# Altium schematic sheet src.SchDoc
size A3
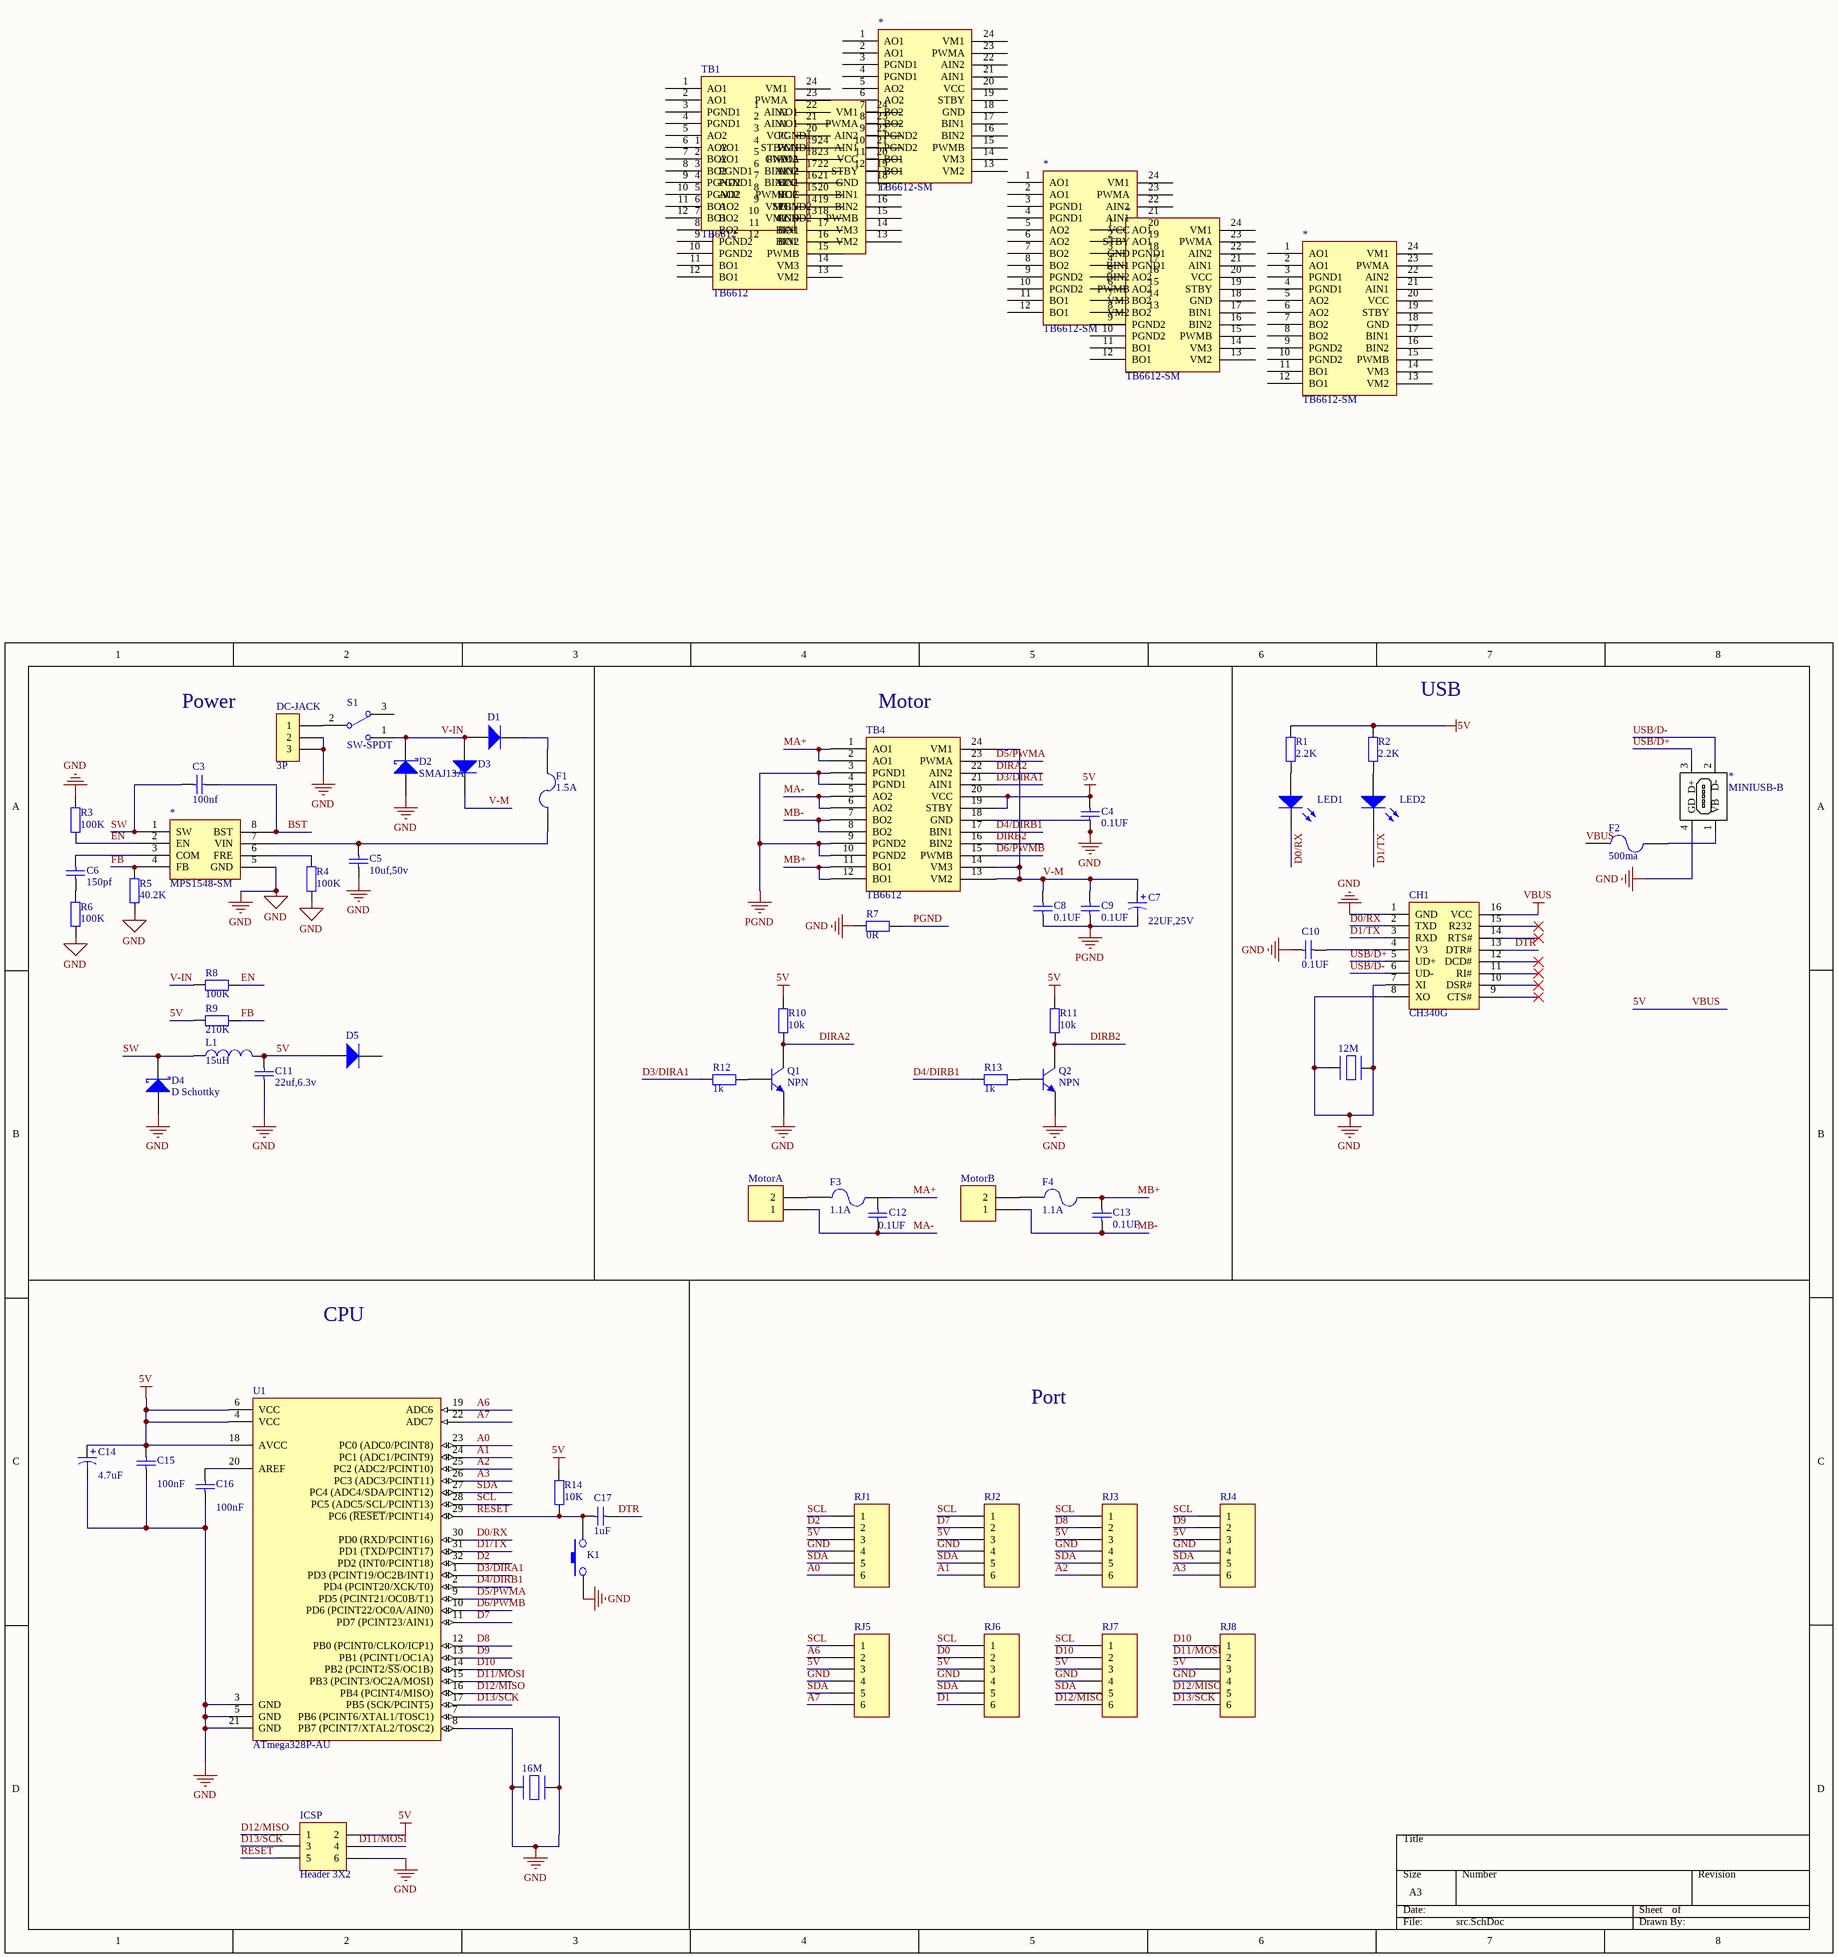
[diagram p0: src.SchDoc]

## Parts
(Parts that share a designator on the sheet are numbered #1, #2 ... from top to bottom, then left to right.)
12M  Crystal-SM  [CRYSTAL-SM]  (value not drawn)
16M  Crystal-SM  [CRYSTAL-SM]  (value not drawn)
*#1  MINIUSB-B  [MINUSB-B]
*#2  TB6612-SM  [SSOP-24]
*#3  MPS1548-SM  [SOP-8]
*#4  TB6612-SM  [SSOP-24]
*#5  TB6612-SM  [SSOP-24]
*#6  TB6612-SM  [SSOP-24]
C3  value 100nf  [C0603]  (hidden comment: Capacitor)
C4  value 0.1UF  [C0603]  (hidden comment: Capacitor)
C5  value 10uf,50v  [C1206]  (hidden comment: Capacitor)
C6  value 150pf  [C0603]  (hidden comment: Capacitor)
C7  value 22UF,25V  [AC10UF-4x5]  (hidden comment: Cap Pol3)
C8  value 0.1UF  [C0603]  (hidden comment: Capacitor)
C9  value 0.1UF  [C0603]  (hidden comment: Capacitor)
C10  value 0.1UF  [C0603]  (hidden comment: Capacitor)
C11  value 22uf,6.3v  [C1206]  (hidden comment: Capacitor)
C12  value 0.1UF  [C0603]  (hidden comment: Capacitor)
C13  value 0.1UF  [C0603]  (hidden comment: Capacitor)
C14  value 4.7uF  [TC3216-A]  (hidden comment: Cap Pol1)
C15  value 100nF  [C0603]  (hidden comment: Cap Semi)
C16  value 100nF  [C0603]  (hidden comment: Cap Semi)
C17  value 1uF  [C0805]  (hidden comment: Cap Semi)
CH1  CH340G  [SO16]
D1  Diode  [SMA]  (value not drawn)
D2  SMAJ13A  [SMA]
D3  Diode  [SMA]  (value not drawn)
D4  D Schottky  [SMA]
D5  Diode  [SMA]  (value not drawn)
DC-JACK  3P  [DC-JACK-005]
F1  1.5A  [R1812]
F2  500ma  [R1812]
F3  1.1A  [R1812]
F4  1.1A  [R1812]
ICSP  Header 3X2  [HDR2X3]
K1  Key-SM  [KEY-SM-3x6x5]  (value not drawn)
L1  value 15uH  [L0630-M]  (hidden comment: Inductor)
LED1  LED  [C0603]  (value not drawn)
LED2  LED  [C0603]  (value not drawn)
MotorA  HDR2-  (value not drawn)
MotorB  HDR2-  (value not drawn)
Q1  NPN  [SOT-23]
Q2  NPN  [SOT-23]
R1  value 2.2K  [R0603]  (hidden comment: Resistor)
R2  value 2.2K  [R0603]  (hidden comment: Resistor)
R3  value 100K  [R0603]  (hidden comment: Resistor)
R4  value 100K  [R0603]  (hidden comment: Resistor)
R5  value 40.2K  [R0603]  (hidden comment: Resistor)
R6  value 100K  [R0603]  (hidden comment: Resistor)
R7  value 0R  [R0603]  (hidden comment: Resistor)
R8  value 100K  [R0603]  (hidden comment: Resistor)
R9  value 210K  [R0603]  (hidden comment: Resistor)
R10  value 10k  [R0603]  (hidden comment: Resistor)
R11  value 10k  [R0603]  (hidden comment: Resistor)
R12  value 1k  [R0603]  (hidden comment: Resistor)
R13  value 1k  [R0603]  (hidden comment: Resistor)
R14  value 10K  [R0603]  (hidden comment: Resistor)
RJ1  RJ12 port  [RJ12-S-12X15X14.5]  (value not drawn)
RJ2  RJ12 port  [RJ12-S-12X15X14.5]  (value not drawn)
RJ3  RJ12 port  [RJ12-S-12X15X14.5]  (value not drawn)
RJ4  RJ12 port  [RJ12-S-12X15X14.5]  (value not drawn)
RJ5  RJ12 port  [RJ12-S-12X15X14.5]  (value not drawn)
RJ6  RJ12 port  [RJ12-S-12X15X14.5]  (value not drawn)
RJ7  RJ12 port  [RJ12-S-12X15X14.5]  (value not drawn)
RJ8  RJ12 port  [RJ12-S-12X15X14.5]  (value not drawn)
S1  SW-SPDT  [TL36WW15050]
TB1  TB6612  [SSOP-24]
TB2  TB6612  [SSOP-24]
TB3  TB6612  [SSOP-24]
TB4  TB6612  [SSOP-24]
U1  ATmega328P-AU  [32A_N]

## Nets
5V: C4.2 C11.1 C14.1 C15.2 CH1.16(VCC) D5.1(A) F2.1 ICSP.2 L1.2 R1.1 R2.1 R9.2 R10.2 R11.2 R14.2 RJ1.3 RJ2.3 RJ3.3 RJ4.3 RJ5.3 RJ6.3 RJ7.3 RJ8.3 TB4.19(STBY) TB4.20(VCC) U1.4(VCC) U1.6(VCC) U1.18(AVCC)  [also labelled VBUS]
GND: 12M.1 12M.2 16M.1 16M.2 *#1.4(GD) *#3.5(GND) C4.1 C5.2 C10.2 C11.2 C14.2 C15.1 C16.1 CH1.1(GND) CH1.7(XI) CH1.8(XO) D2.1(A) D4.1(A) DC-JACK.2 DC-JACK.3 ICSP.6 K1.1 Q1.3(E) Q2.3(E) R3.1 R4.1 R5.1 R6.1 R7.1 RJ1.4 RJ2.4 RJ3.4 RJ4.4 RJ5.4 RJ6.4 RJ7.4 RJ8.4 TB4.18(GND) U1.3(GND) U1.5(GND) U1.7(PB6_(PCINT6/XTAL1/TOSC1)) U1.8(PB7_(PCINT7/XTAL2/TOSC2)) U1.21(GND)
PGND: C7.2 C8.1 C9.1 R7.2 TB4.3(PGND1) TB4.4(PGND1) TB4.9(PGND2) TB4.10(PGND2)
A0: RJ1.6 U1.23(PC0_(ADC0/PCINT8))
A1: RJ2.6 U1.24(PC1_(ADC1/PCINT9))
A2: RJ3.6 U1.25(PC2_(ADC2/PCINT10))
A3: RJ4.6 U1.26(PC3_(ADC3/PCINT11))
A6: RJ5.2 U1.19(ADC6)
A7: RJ5.6 U1.22(ADC7)
BST: *#3.8(BST) C3.2
D0: RJ6.2
D0/RX: CH1.2(TXD) LED1.2(K) U1.30(PD0_(RXD/PCINT16))
D1: RJ6.6
D1/TX: CH1.3(RXD) LED2.2(K) U1.31(PD1_(TXD/PCINT17))
D2: RJ1.2 U1.32(PD2_(INT0/PCINT18))
D3/DIRA1: R12.2 TB4.21(AIN1) U1.1(PD3_(PCINT19/OC2B/INT1))
D4/DIRB1: R13.2 TB4.17(BIN1) U1.2(PD4_(PCINT20/XCK/T0))
D5/PWMA: TB4.23(PWMA) U1.9(PD5_(PCINT21/OC0B/T1))
D6/PWMB: TB4.15(PWMB) U1.10(PD6_(PCINT22/OC0A/AIN0))
D7: RJ2.2 U1.11(PD7_(PCINT23/AIN1))
D8: RJ3.2 U1.12(PB0_(PCINT0/CLKO/ICP1))
D9: RJ4.2 U1.13(PB1_(PCINT1/OC1A))
D10: RJ7.2 RJ8.1 U1.14(PB2_(PCINT2/~{SS}/OC1B))
D11/MOSI: RJ8.2 U1.15(PB3_(PCINT3/OC2A/MOSI))
D12/MISO: ICSP.1 RJ7.6 RJ8.5 U1.16(PB4_(PCINT4/MISO))
D13/SCK: ICSP.3 RJ8.6 U1.17(PB5_(SCK/PCINT5))
DIRA2: Q1.1(C) R10.1 TB4.22(AIN2)
DIRB2: Q2.1(C) R11.1 TB4.16(BIN2)
DTR: C17.1 CH1.13(DTR#)
EN: *#3.2(EN) R3.2 R8.1
FB: *#3.4(FB) R5.2 R9.1
MA+: F3.2 TB4.1(AO1) TB4.2(AO1)
MA-: C12.1 MotorA.1 TB4.5(AO2) TB4.6(AO2)
MB+: C13.2 F4.2 TB4.11(BO1) TB4.12(BO1)
MB-: C13.1 MotorB.1 TB4.7(BO2) TB4.8(BO2)
RESET: C17.2 ICSP.5 K1.2 R14.1 U1.29(PC6_(~{RESET}/PCINT14))
SCL: RJ1.1 RJ2.1 RJ3.1 RJ4.1 RJ5.1 RJ6.1 RJ7.1 U1.28(PC5_(ADC5/SCL/PCINT13))
SDA: RJ1.5 RJ2.5 RJ3.5 RJ4.5 RJ5.5 RJ6.5 RJ7.5 U1.27(PC4_(ADC4/SDA/PCINT12))
SW: *#3.1(SW) C3.1 D4.2(K) L1.1
USB/D+: *#1.3(D+) CH1.5(UD+)
USB/D-: *#1.2(D-) CH1.6(UD-)
V-IN: D1.1(A) D2.2(K) D3.1(A) R8.2 S1.1
V-M: C7.1 C8.2 C9.2 D3.2(K) TB4.13(VM2) TB4.14(VM3) TB4.24(VM1)
Net*#1_1: *#1.1(VB) F2.2
Net*#2_10: *#2.10(PGND2) TB3.24(VM1)
Net*#2_11: *#2.11(BO1) TB3.23(PWMA)
Net*#2_12: *#2.12(BO1) TB3.22(AIN2)
Net*#3_3: *#3.3(COM) C6.1
Net*#3_6: *#3.6(FRE) R4.2
Net*#3_7: *#3.7(VIN) C5.1 F1.2
NetC6_2: C6.2 R6.2
NetC10_1: C10.1 CH1.4(V3)
NetC16_2: C16.2 U1.20(AREF)
NetD1_2: D1.2(K) F1.1
NetDC-JACK_1: DC-JACK.1 S1.2
NetF3_1: F3.1 MotorA.2
NetF4_1: F4.1 MotorB.2
NetLED1_1: LED1.1(A) R1.2
NetLED2_1: LED2.1(A) R2.2
NetQ1_2: Q1.2(B) R12.1
NetQ2_2: Q2.2(B) R13.1

Not connected (* = marked no-connect by the designer): *#2 1(AO1) 2(AO1) 3(PGND1) 4(PGND1) 5(AO2) 6(AO2) 7(BO2) 8(BO2) 9(PGND2) 13(VM2) 14(VM3) 15(PWMB) 16(BIN2) 17(BIN1) 18(GND) 19(STBY) 20(VCC) 21(AIN1) 22(AIN2) 23(PWMA) 24(VM1); *#4 1(AO1) 2(AO1) 3(PGND1) 4(PGND1) 5(AO2) 6(AO2) 7(BO2) 8(BO2) 9(PGND2) 10(PGND2) 11(BO1) 12(BO1) 13(VM2) 14(VM3) 15(PWMB) 16(BIN2) 17(BIN1) 18(GND) 19(STBY) 20(VCC) 21(AIN1) 22(AIN2) 23(PWMA) 24(VM1); *#5 1(AO1) 2(AO1) 3(PGND1) 4(PGND1) 5(AO2) 6(AO2) 7(BO2) 8(BO2) 9(PGND2) 10(PGND2) 11(BO1) 12(BO1) 13(VM2) 14(VM3) 15(PWMB) 16(BIN2) 17(BIN1) 18(GND) 19(STBY) 20(VCC) 21(AIN1) 22(AIN2) 23(PWMA) 24(VM1); *#6 1(AO1) 2(AO1) 3(PGND1) 4(PGND1) 5(AO2) 6(AO2) 7(BO2) 8(BO2) 9(PGND2) 10(PGND2) 11(BO1) 12(BO1) 13(VM2) 14(VM3) 15(PWMB) 16(BIN2) 17(BIN1) 18(GND) 19(STBY) 20(VCC) 21(AIN1) 22(AIN2) 23(PWMA) 24(VM1); C12 2; CH1 9(CTS#)* 10(DSR#)* 11(RI#)* 12(DCD#)* 14(RTS#)* 15(R232)*; D5 2(K); ICSP 4; S1 3; TB1 1(AO1) 2(AO1) 3(PGND1) 4(PGND1) 5(AO2) 6(AO2) 7(BO2) 8(BO2) 9(PGND2) 10(PGND2) 11(BO1) 12(BO1) 13(VM2) 14(VM3) 15(PWMB) 16(BIN2) 17(BIN1) 18(GND) 19(STBY) 20(VCC) 21(AIN1) 22(AIN2) 23(PWMA) 24(VM1); TB2 1(AO1) 2(AO1) 3(PGND1) 4(PGND1) 5(AO2) 6(AO2) 7(BO2) 8(BO2) 9(PGND2) 10(PGND2) 11(BO1) 12(BO1) 13(VM2) 14(VM3) 15(PWMB) 16(BIN2) 17(BIN1) 18(GND) 19(STBY) 20(VCC) 21(AIN1) 22(AIN2) 23(PWMA) 24(VM1); TB3 1(AO1) 2(AO1) 3(PGND1) 4(PGND1) 5(AO2) 6(AO2) 7(BO2) 8(BO2) 9(PGND2) 10(PGND2) 11(BO1) 12(BO1) 13(VM2) 14(VM3) 15(PWMB) 16(BIN2) 17(BIN1) 18(GND) 19(STBY) 20(VCC) 21(AIN1)

## Notes on the sheet
- Power
- (near TB4) Motor
- USB
- CPU
- Port
- Labels drawn without touching a wire or pin: D11/MOSI

## Library data of the parts
12M 16M = Crystal-SM: Crystal-SM-8M
C7 = Cap Pol3: Polarized Capacitor (Surface Mount); Published: 8-Jun-2000; LatestRevisionDate: 29-May-2009; LatestRevisionNote: IPC-7351 Footprint Added.; PackageReference: C0805; Publisher: Altium Limited; PackageDescription: Chip Capacitor
C14 = Cap Pol1: Polarized Capacitor (Radial); Published: 8-Jun-2000; LatestRevisionDate: 17-Jul-2002; LatestRevisionNote: Re-released for DXP Platform.; PackageReference: RB7.6-15; Publisher: Altium Limited; PackageDescription: Polarized Capacitor (Radial); 2 Leads
C15-C17 = Cap Semi: Capacitor (Semiconductor SIM Model); Published: 8-Jun-2000; LatestRevisionDate: 29-May-2009; LatestRevisionNote: IPC-7351 Footprint Added.; PackageReference: C1206; Publisher: Altium Limited; PackageDescription: Chip Capacitor
CH1 = CH340G-SOP16: CH340G SSOP 16pin
D1 D3 D5 = Diode: Default Diode; Published: 8-Jun-2000; LatestRevisionDate: 17-Jul-2002; LatestRevisionNote: Re-released for DXP Platform.; PackageVersion: Sep-1996; PackageReference: SMC; Publisher: Altium Limited; PackageDescription: DO-214-AB/SMC; 2 C-Bend Leads; Body 7.9 x 5.9 mm, inc. leads (LxW); Code_JEDEC: DO-214-AB
D2 D4 = D Schottky: Schottky Diode; Published: 8-Jun-2000; LatestRevisionDate: 17-Jul-2002; LatestRevisionNote: Re-released for DXP Platform.; PackageReference: SMB; Publisher: Altium Limited; PackageDescription: DO-214-AA/SMB; 2 C-Bend Leads; Body 5.3 x 3.6 mm, inc. leads (LxW); Code_JEDEC: DO-214-AA
F1-F4 = Fuse 2: Fuse; Published: 8-Jun-2000; LatestRevisionDate: 17-Jul-2002; LatestRevisionNote: Re-released for DXP Platform.; PackageReference: PIN-W2/E2.8; Publisher: Altium Limited; PackageDescription: Thru-Hole; 2 Leads
ICSP = Header 3X2: Header, 3-Pin, Dual row; LatestRevisionDate: 17-Jul-2002; LatestRevisionNote: Re-released for DXP Platform.; Publisher: Altium Limited
L1 = Inductor: Code_IEC: 1005; Published: 8-Jun-2000; LatestRevisionDate: 29-May-2009; LatestRevisionNote: IPC-7351 Footprint Added.; PackageReference: 0402-A; Publisher: Altium Limited; PackageDescription: Chip Inductor; Code_JEITA: 0402
LED1 LED2 = LED-SM: LED  SMD
MotorA MotorB = HDR2-2.54mm: Header  2pin
Q1 Q2 = NPN: NPN Bipolar Transistor; pin to pad: 2>3 3>2; Published: 8-Jun-2000; LatestRevisionDate: 17-Jul-2002; LatestRevisionNote: Re-released for DXP Platform.; PackageReference: TO-226-AA; Publisher: Altium Limited; PackageDescription: TO, Flat Index; 3 In-Line, Axial Leads; Body Dia. 4.8mm; Leads 0.55 x 0.51 mm (max); Code_JEDEC: TO-226-AA
RJ1-RJ8 = RJ12
S1 = SW-SPDT: SPDT Subminiature Toggle Switch, Right Angle Mounting, Vertical Actuation; Published: 24-Mar-1999; LatestRevisionDate: 17-Dec-2003; LatestRevisionNote: Schematic revised, PCB Footprint replaced.; DatasheetVersion: 05-Dec-2000; PackageReference: TL36WW15050; Publisher: Altium Limited; PackageDescription: Switch; 4 Leads; ComponentLink1Description: Manufacturer Link; ComponentLink1URL: http://www.apem.com
TB1-TB4 = TB6612-SM: TB6612 Motor driver
U1 = ATmega328P-AU: 8-bit AVR Microcontroller, 32KB Flash, 1KB EEPROM, 2KB SRAM, 32-pin TQFP, Industrial Grade (-40°C to 85°C); Published: 1-Apr-2010; DatasheetVersion: revA, Jan-2010; PackageVersion: revB, Oct-2001; PackageReference: 32A; Publisher: Altium Limited; PackageDescription: 32-Lead, 7x7x1.0 mm Body, 0.8mm Lead Pitch, Thin Profile Plastic Quad Flat Package (TQFP); Supplier 1: Digi-Key; Supplier Part Number 1: ATMEGA328P-AU-ND; Supplier 2: Farnell; Supplier Part Number 2: 1715486; Supplier 3: Mouser; Supplier Part Number 3: 556-ATMEGA328P-AU; Code_JEDEC: MS-026-ABA; ComponentLink1Description: Manufacturer Link; ComponentLink1URL: http://www.atmel.com/products/avr/default.asp?; ComponentLink2Description: ATmega48A/48PA/88A/88PA/168A/168PA/328/328P Datasheet; ComponentLink2URL: http://www.atmel.com/dyn/resources/prod_documents/8271.pdf; ComponentLink3Description: ATmega48A/48PA/88A/88PA/168A/168PA/328/328P Summary; ComponentLink3URL: http://www.atmel.com/dyn/resources/prod_documents/8271S.pdf; ComponentLink4Description: Atmel.com Home; ComponentLink4URL: http://www.atmel.com
C3-C6 C8-C13 = Capacitor: Published: 8-Jun-2000; LatestRevisionDate: 17-Jul-2002; LatestRevisionNote: Re-released for DXP Platform.; PackageReference: RAD-0.3; Publisher: Altium Limited; PackageDescription: Radial Cap, Thru-Hole; 2 Leads; 0.3 in Pin Spacing
R1-R14 = Resistor: Published: 8-Jun-2000; LatestRevisionDate: 17-Jul-2002; LatestRevisionNote: Re-released for DXP Platform.; PackageReference: AXIAL-0.4; Publisher: Altium Limited; PackageDescription: Axial Device, Thru-Hole; 2 Leads; 0.4 in Pin Spacing